# Altium schematic sheet 16_Analog&Audio.SchDoc
size A4
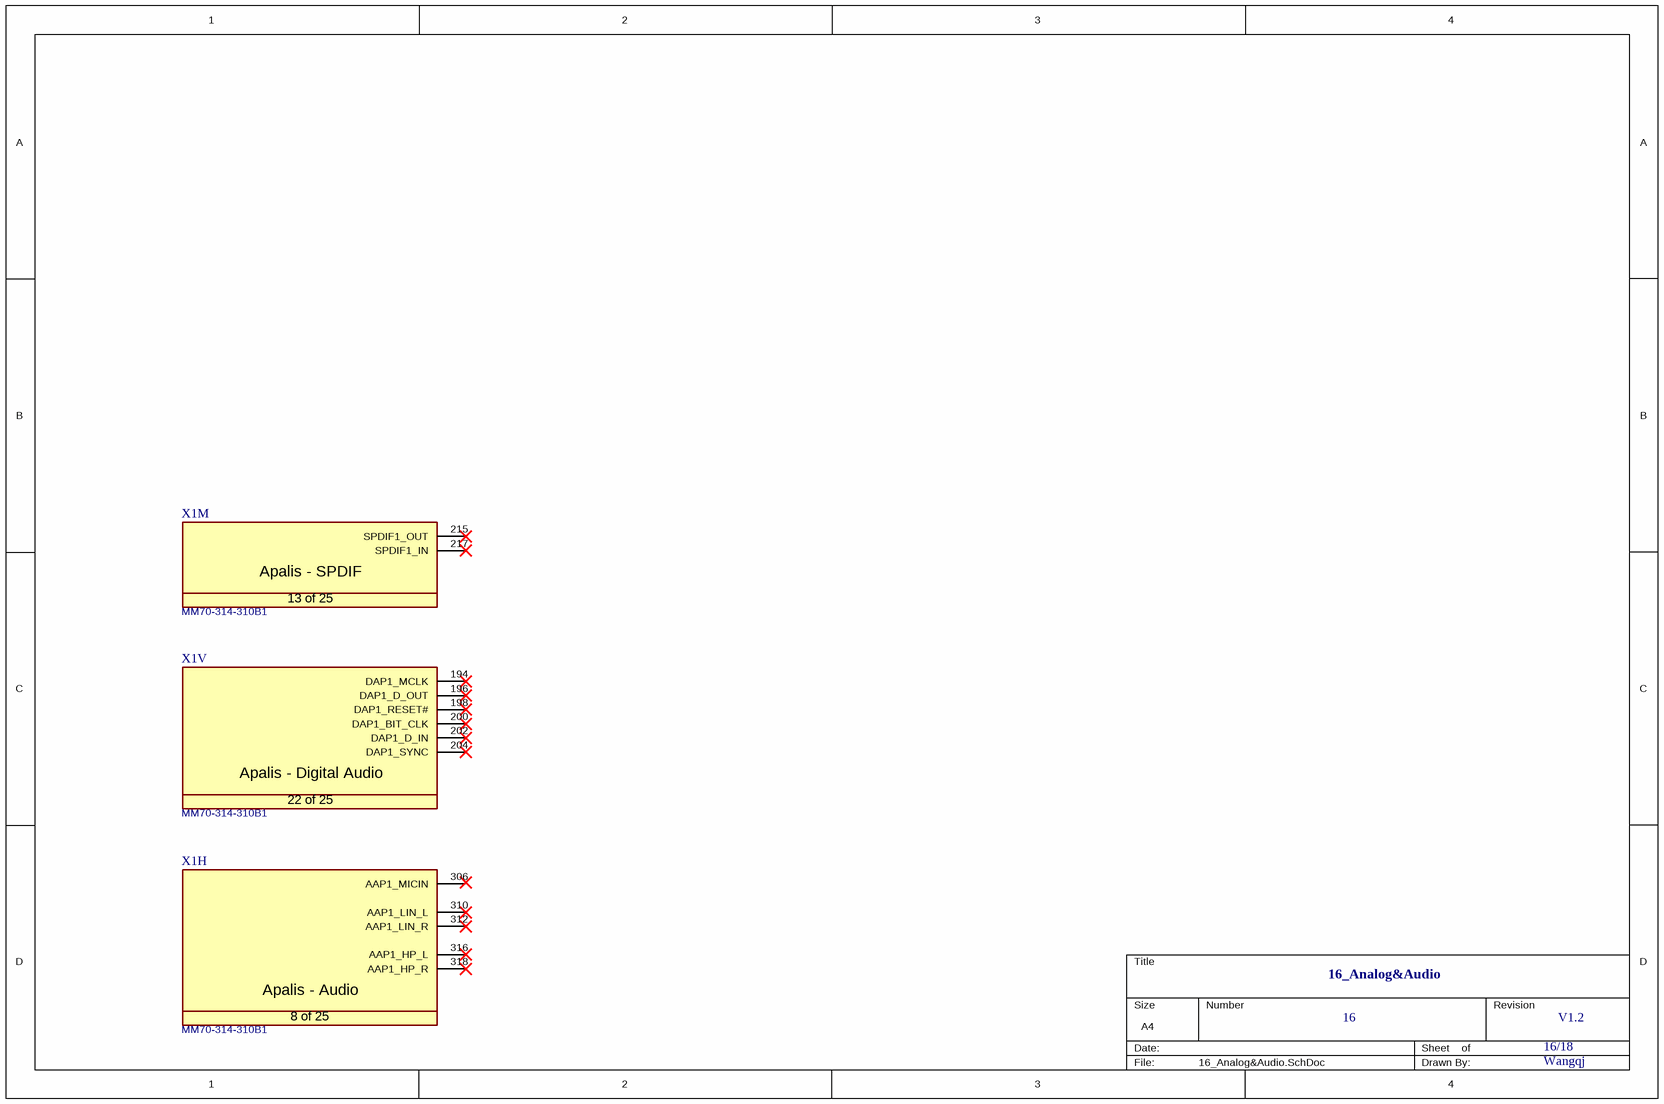
[diagram p0: 16_Analog&Audio.SchDoc]

## Parts
X1  Manufacturer Part No.: MM70-314-310B1  [T_JAE_MM70-314-310B1]  (hidden comment: CON-JAE-MM70-314-310B1-314-0.5mm)  (parts H,M,V of 25)

## Nets

Not connected (* = marked no-connect by the designer): X1 194(DAP1_MCLK)* 196(DAP1_D_OUT)* 198(DAP1_RESET#)* 200(DAP1_BIT_CLK)* 202(DAP1_D_IN)* 204(DAP1_SYNC)* 215(SPDIF1_OUT)* 217(SPDIF1_IN)* 306(AAP1_MICIN) 310(AAP1_LIN_L)* 312(AAP1_LIN_R)* 316(AAP1_HP_L)* 318(AAP1_HP_R)*

## Notes on the sheet
- 16_Analog&Audio
- 16
- 16/18
- V1.2
- Wangqj
- (in symbol CON-JAE-MM70-314-310B1-314-0.5mm, part H) Apalis - Audio; 8 of 25
- (in symbol CON-JAE-MM70-314-310B1-314-0.5mm, part M) Apalis - SPDIF; 13 of 25
- (in symbol CON-JAE-MM70-314-310B1-314-0.5mm, part V) Apalis - Digital Audio; 22 of 25

## Library data of the parts
X1 = CON-JAE-MM70-314-310B1-314-0.5mm: MXM3 Connector; Manufacturer Name: JAE; No. of ways: 314